# EasyEDA Pro project ProPrj_2 模块_2024-10-26.epro

# Schematic Schematic1
Board Name: Board1; Create Date: 2024-10-13; Page Name: P1; Project Name: 2 模块; Schematic Name: Schematic1; Update Date: 2024-10-16; Company: 嘉立创EDA; Page Size: A4; Version: V1.0
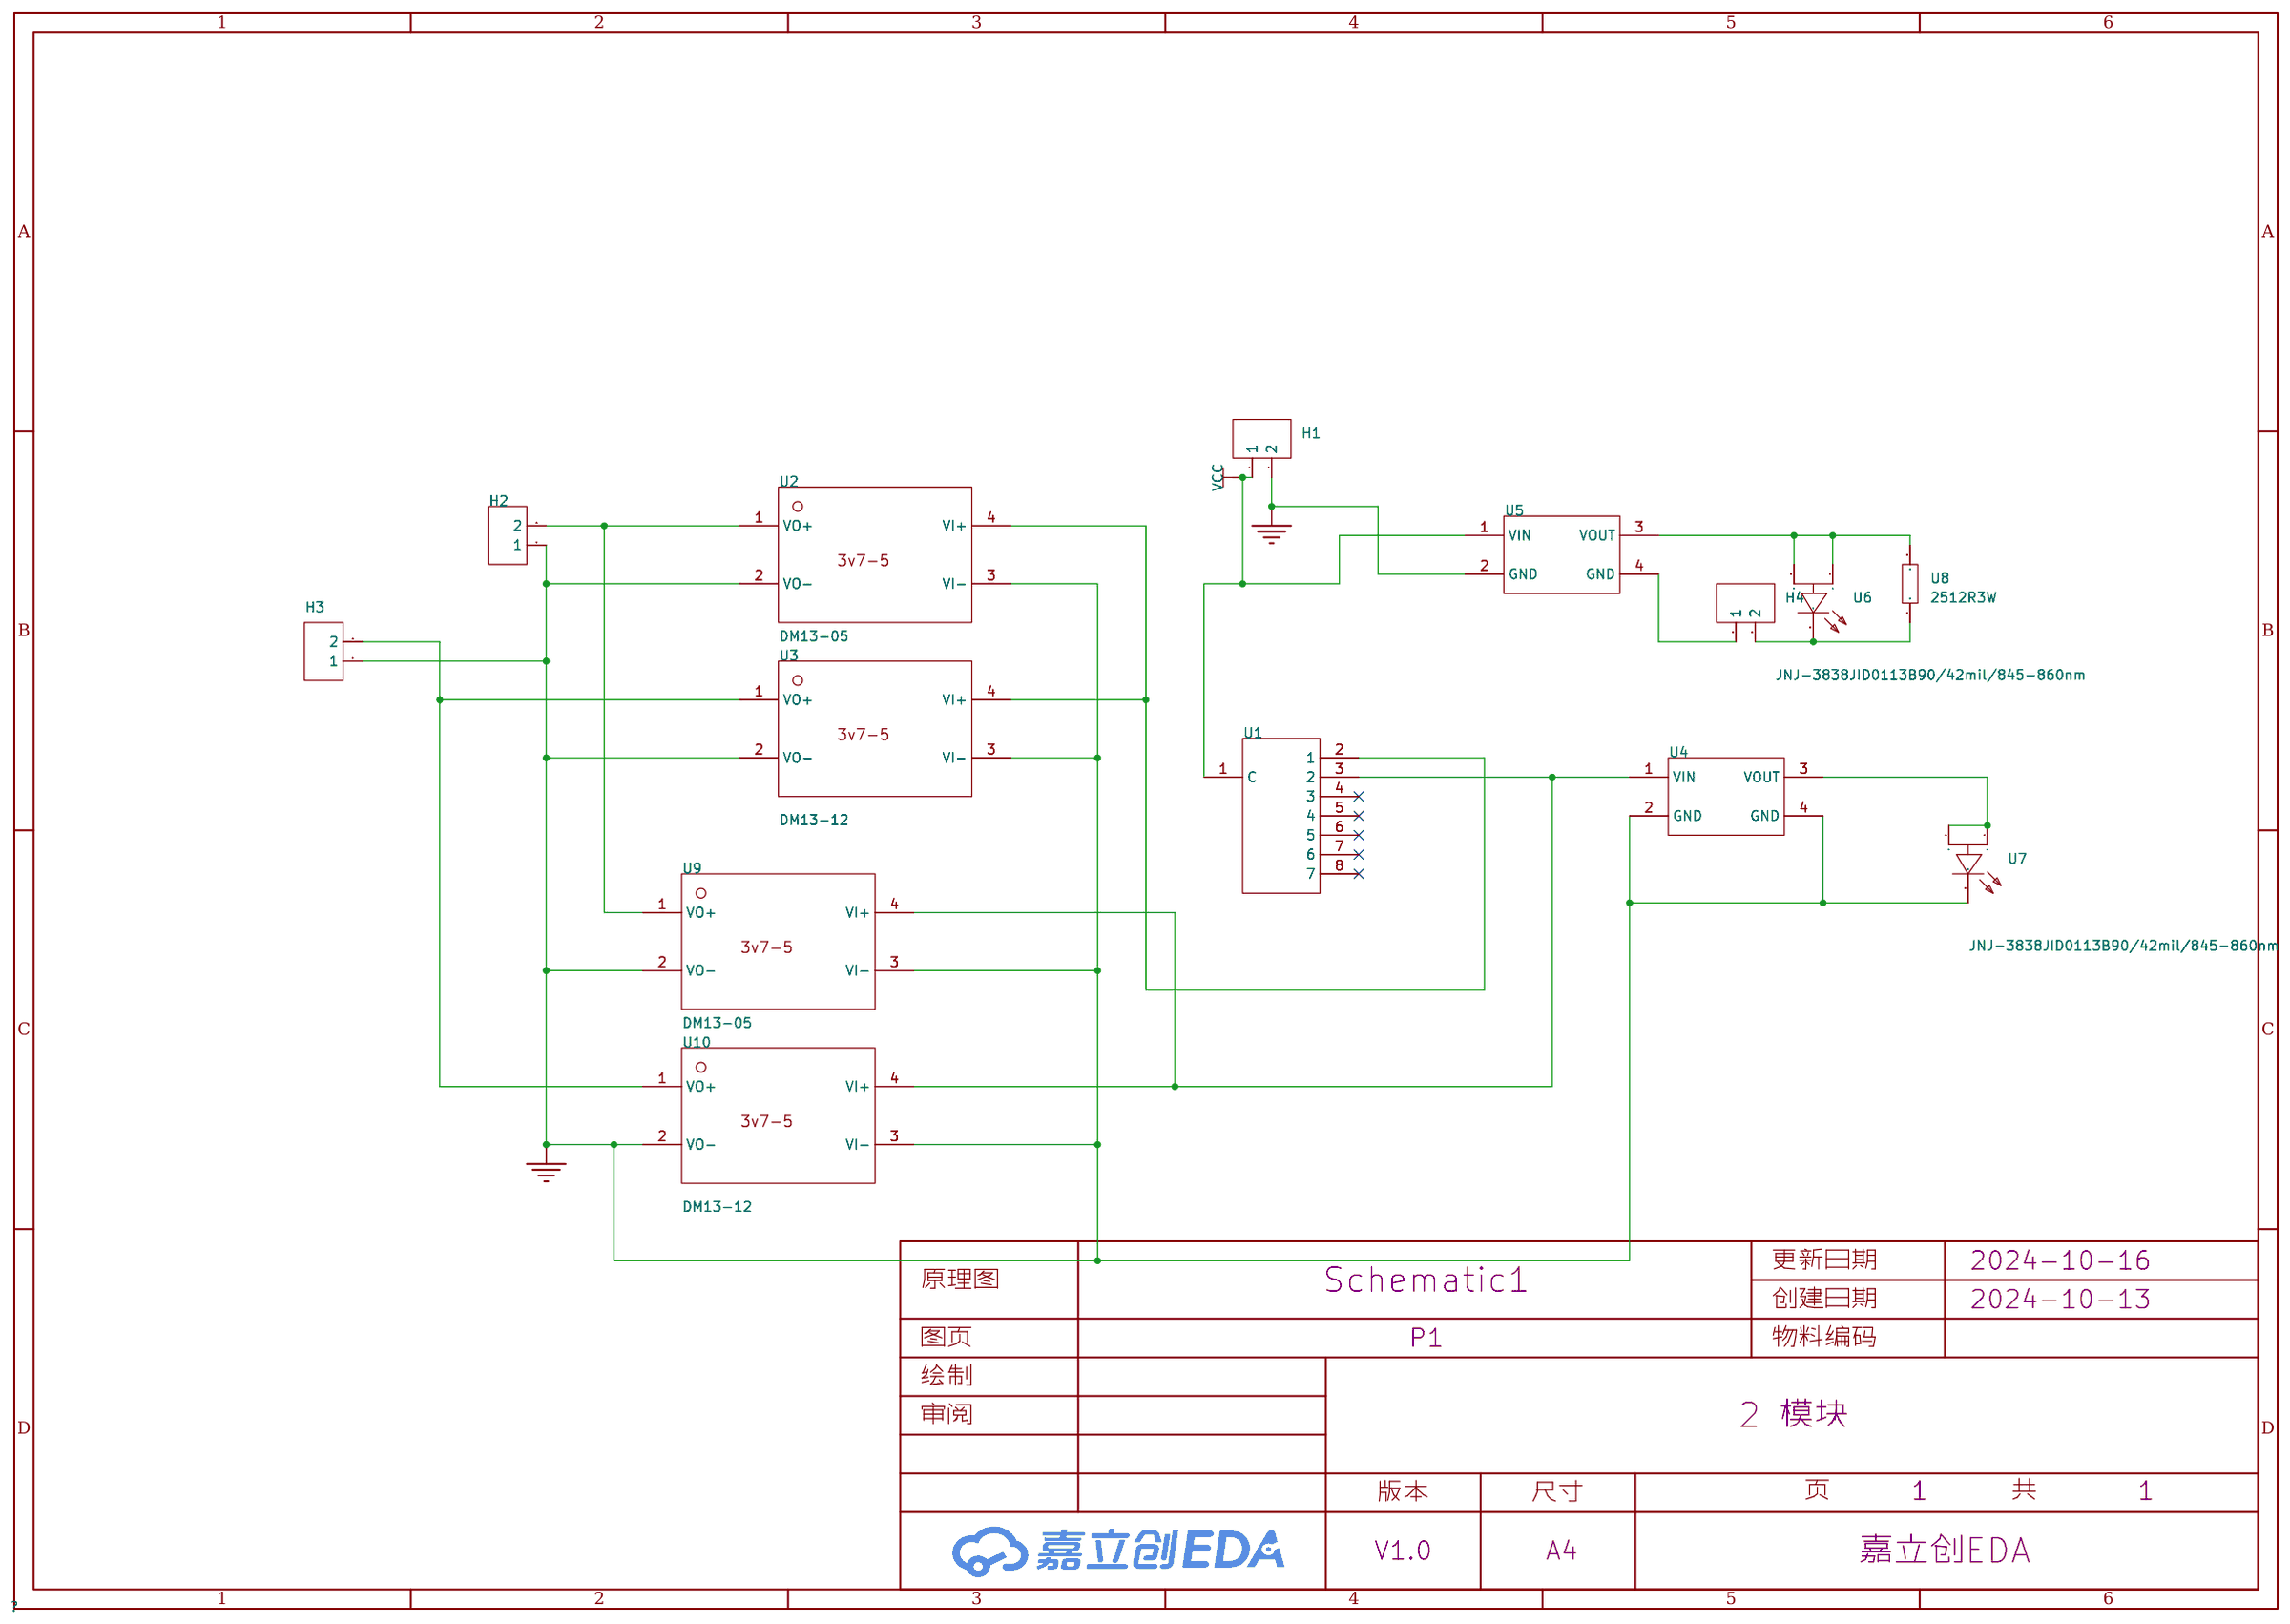
[diagram p0: schematic sheet]

## Parts
H1  -  [HDR-TH_2P-P2.54-V-F]
H2  -  [HDR-TH_2P-P2.54-V-F]
H3  -  [HDR-TH_2P-P2.54-V-F]
H4  -  [HDR-TH_2P-P2.54-V-F]
U1  -  [HDR-TH_3P-P2.54-V-F]
U2  DM13-05  [DM13-05]
U3  DM13-12  [DM13-05]
U4  AMS1117模块 COPY  [D01]
U5  AMS1117模块 COPY  [D01]
U6  JNJ-3838JID0113B90/42mil/845-860nm  [LED-SMD_3P-L3.8-W3.8_JNJ-3838JI0113B90]
U7  JNJ-3838JID0113B90/42mil/845-860nm  [LED-SMD_3P-L3.8-W3.8_JNJ-3838JI0113B90]
U8  2512R3W  [R2512]
U9  DM13-05  [DM13-05]
U10  DM13-12  [DM13-05]

## Library data of the parts
H1-H4 = HDR-F_2.54_1x2P: Supplier Part: C49661; Supplier Footprint: 插件
U1 = mini小型旋转波段开关: https://detail.tmall.com/item.htm?abbucket=20&id=710720328864&ns=1&skuId=4986250817052&spm=a21n57.1.0.0.6947523cw75yEM
U2 U3 U9 U10 = DM13-05: 3.7-5; _: 3
U4 U5 = AMS1117模块 COPY: Supplier: risym; link: https://m.tb.cn/h.VOj4bnW?sm=f9af33
U6 U7 = JNJ-3838JID0113B90/42mil/845-860nm: 正向电压:2.8V~3.6V;波长:840nm~870nm;辐射强度:900mW/Sr;正向电流-DC (If):1A;视角:90°;; LCSC Part Name: 3838晶元堆叠42mil球头90度灯源845-860nm; Supplier Part: C19185848; Manufacturer: JNJ OPTOELECTRONICS(强生光电); Supplier Footprint: 3838; JLCPCB Part Class: 扩展库; Datasheet: https://atta.szlcsc.com/upload/public/pdf/source/20231103/777D8A6519DA7058B88AF7E8216F8756.pdf; Supplier: LCSC; Vf - Forward Voltage: 2.8V~3.6V; Wavelength: 840nm~870nm; Radiant Intensity: 900mW/Sr; Current - DC Forward (If): 1A; View Angle: 90°; Operating Temperature: -40℃~+100℃
U8 = 2512R3W: Supplier Part: C9900003295; JLCPCB Part Class: 扩展库; Supplier: LCSC

## Nets
GND: H1.2 H2.1 H3.1 U2.2(VO-) U2.3(VI-) U3.2(VO-) U3.3(VI-) U4.2(GND) U4.4(GND) U5.2(GND) U7.3(K) U9.2(VO-) U9.3(VI-) U10.2(VO-) U10.3(VI-)
VCC: H1.1 U1.1(C) U5.1(VIN)
$1N3243: U5.3(VOUT) U6.1(A) U6.2(A) U8.2
$1N3257: H4.1 U5.4(GND)
$1N3292: H4.2 U6.3(K) U8.1
$1N3305: U4.3(VOUT) U7.1(A) U7.2(A)
Net-(H2-2): H2.2 U2.1(VO+) U9.1(VO+)
Net-(H3-2): H3.2 U3.1(VO+) U10.1(VO+)
Net-(U1-2): U1.2(1) U2.4(VI+) U3.4(VI+)
Net-(U1-3): U1.3(2) U4.1(VIN) U9.4(VI+) U10.4(VI+)

Not connected (* = marked no-connect by the designer): U1 4(3)* 5(4)* 6(5)* 7(6)* 8(7)*

# Board PCB1
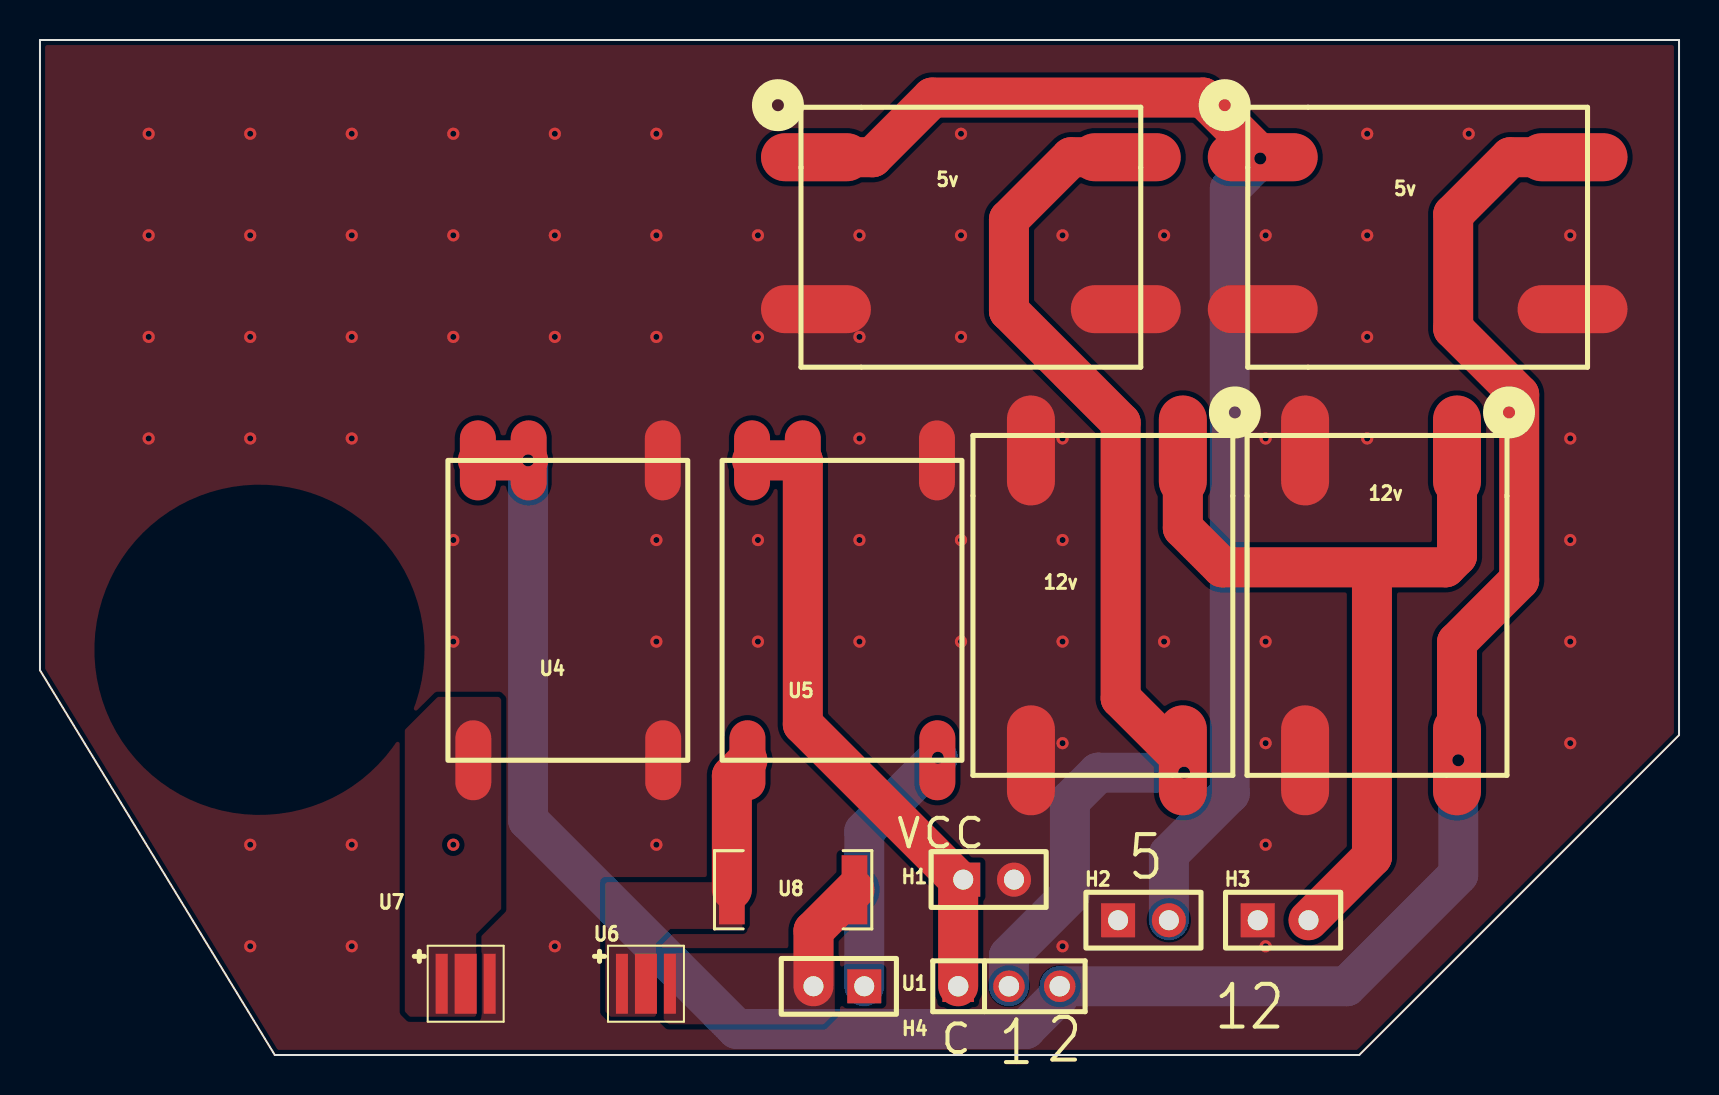
[diagram p1: board, top side]
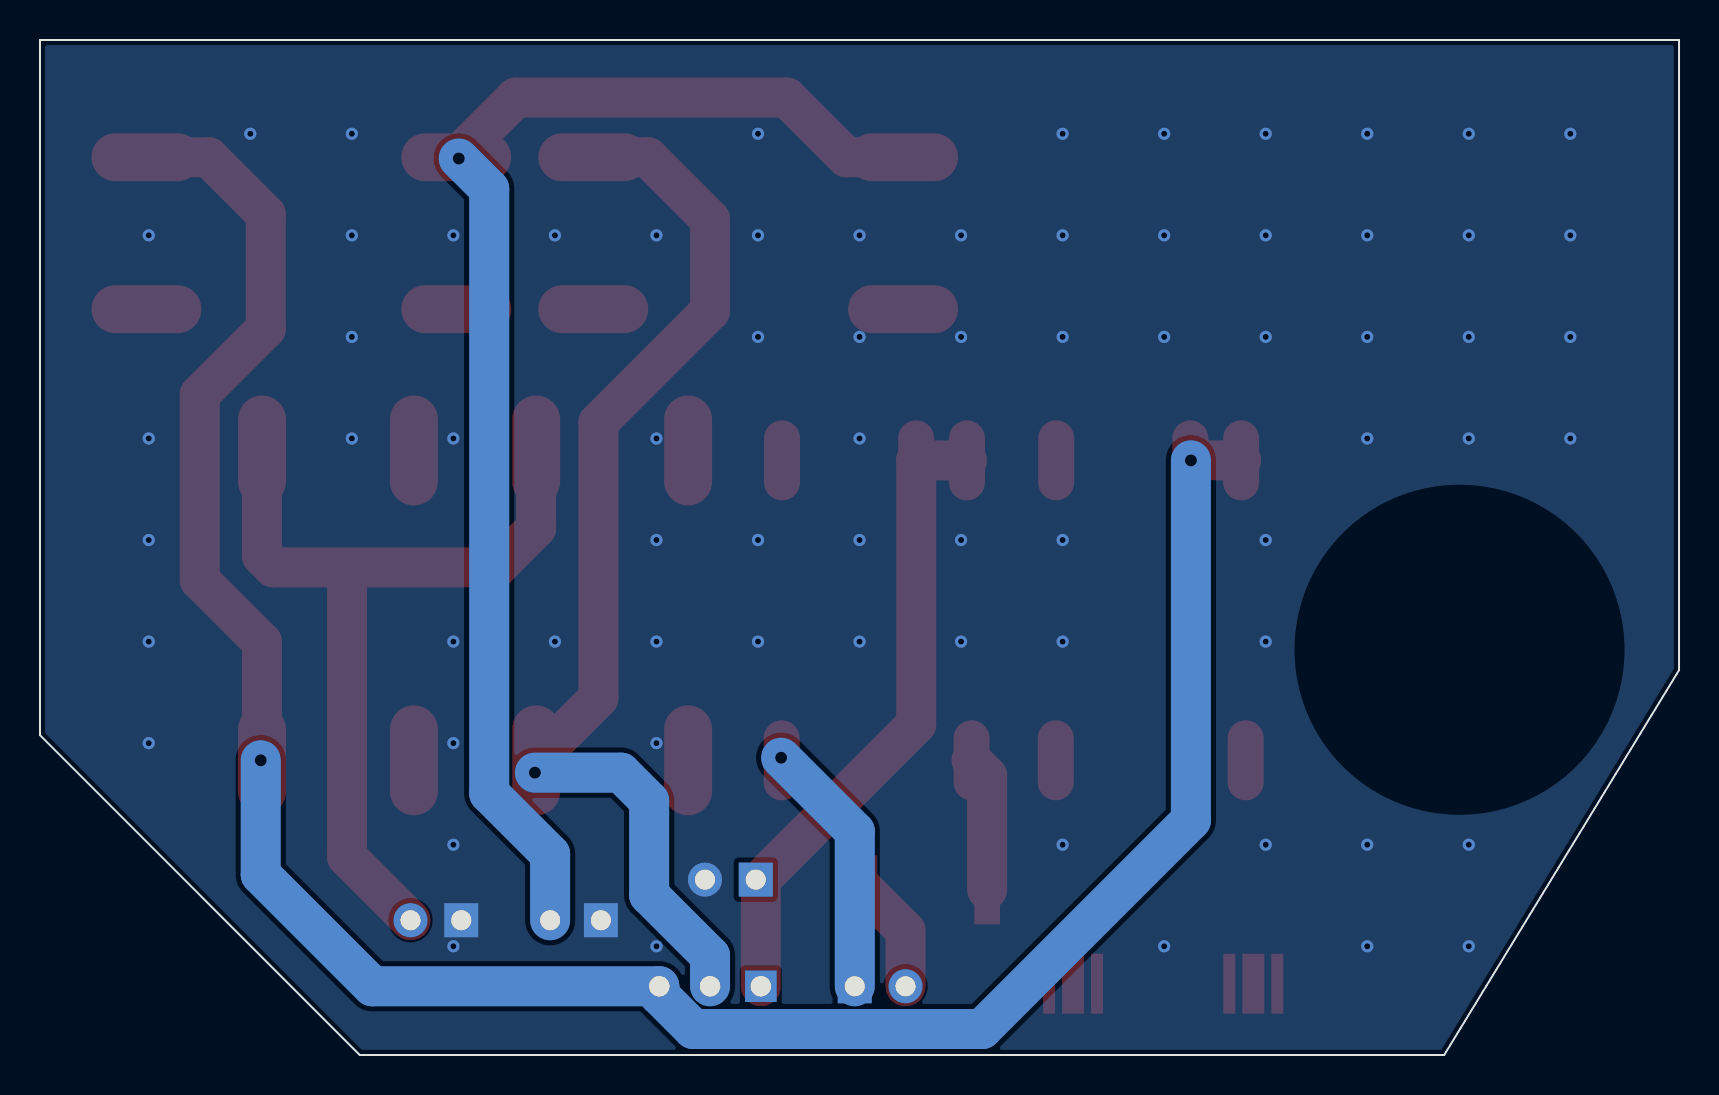
[diagram p2: board, bottom side, seen from below]

Outline 82 x 50.77 mm; copper layers: Top Layer, Bottom Layer. Coordinates in mm from the lower left corner of the outline.
Outline path: 0,50.77 0,19.25 11.75,0 66,0 82,16 82,50.77 0,50.77
Stack: Top Layer 0.035mm / Dielectric1 1.51mm FR4 er 4.5 / Bottom Layer 0.035mm

## Design rules (mm)
template: 自定义配置
spacing copperThickness1oz (default): track to track 0.102, other pairs 0.152 to 0.3
spacing copperThickness2oz: track to track 0.203, other pairs 0.152 to 0.3
track width copperThickness1oz (default): min 0.127, default 0.254, max 2.54
track width copperThickness2oz: min 0.203, default 0.254, max 2.54
differential pair differentialPair (default): width min 0.127, default 0.254, max 2.54; gap min 0.152, default 0.152
via viaSize (default): diameter min 0.5, default 0.61, max 10; hole min 0.3, default 0.305, max 6.3

## Placement (name value [footprint] x y rotation side)
5v  -  [DM13-05]  46.57 40.9 0 top
5v#2  -  [DM13-05]  68.92 40.9 0 top
12v  -  [DM13-05]  53.17 22.49 270 top
12v#2  -  [DM13-05]  66.89 22.49 270 top
H1  -  [HDR-TH_2P-P2.54-V-F]  47.46 8.77 0 top
H2  -  [HDR-TH_2P-P2.54-V-F]  55.21 6.74 0 top
H3  -  [HDR-TH_2P-P2.54-V-F]  62.19 6.74 0 top
H4  -  [HDR-TH_2P-P2.54-V-F]  39.97 3.44 180 top
U1  -  [HDR-TH_3P-P2.54-V-F]  48.48 3.44 0 top
U4  AMS1117模块 COPY  [D01]  27.39 22.62 90 top
U5  AMS1117模块 COPY  [D01]  41.11 22.62 90 top
U6  JNJ-3838JID0113B90/42mil/845-860nm  [LED-SMD_3P-L3.8-W3.8_JNJ-3838JI0113B90]  30.32 3.57 0 top
U7  JNJ-3838JID0113B90/42mil/845-860nm  [LED-SMD_3P-L3.8-W3.8_JNJ-3838JI0113B90]  21.3 3.57 0 top
U8  2512R3W  [R2512]  37.68 8.26 180 top

## Footprints (pads in the part's own frame, mm; a bottom-side part is the same pattern mirrored in y, then rotated)
D01
  oval 4x1.8 smd: 1(7.126,5.486) 1(7.126,2.946) 2(7.126,-3.765) 3(-7.874,5.715) 4(-7.874,-3.785)
DM13-05
  oval 5.499x2.401 smd: 1(-7.75,4) 2(-7.75,-3.599) 3(7.75,-3.599) 4(7.75,4)
HDR-TH_2P-P2.54-V-F
  rect 1.7x1.7 hole 1: 1(-1.27,0)
  round 1.7 hole 1: 2(1.27,0)
HDR-TH_3P-P2.54-V-F
  rect 1.575x1.575 hole 1.02: 1(-2.54,0)
  round 1.575 hole 1.02: 2(0,0) 3(2.54,0)
LED-SMD_3P-L3.8-W3.8_JNJ-3838JI0113B90
  rect 0.6x3 smd: 1(-1.2,0) 3(1.2,0)
  rect 1.1x3 smd: 2(0,0)
R2512
  rect 1.282x3.456 smd: 1(-3.067,0) 2(3.067,0)

## Nets
GND: 5v.2 5v.3 5v#2.2 5v#2.3 12v.2 12v.3 12v#2.2 12v#2.3 H1.2 H2.1 H3.1 U4.2 U4.4 U5.2 U7.3
VCC: H1.1 U1.1 U5.1
$1N2924: 5v.1 5v#2.1 H2.2
$1N2940: 12v.1 12v#2.1 H3.2
$1N3069: 5v#2.4 12v#2.4 U1.3 U4.1
$1N3141: 5v.4 12v.4 U1.2
$1N3243: U5.3 U6.1 U6.2 U8.2
$1N3257: H4.1 U5.4
$1N3292: H4.2 U6.3 U8.1
$1N3305: U4.3 U7.1 U7.2

## Via types
v1: diameter 0.61, hole 0.305, Top Layer to Bottom Layer, 70 vias
v2: diameter 1, hole 0.6, Top Layer to Bottom Layer, 5 vias

## Routing (per net, layer and track width the routed paths; a pad name or vN(x,y) marks a point on that pad's centre or on a via; arc(x,y) is an arc through that point)
GND:
  vias: v1(5.44,46.08) v1(5.44,41) v1(5.44,35.92) v1(5.44,30.84) v1(10.52,46.08) v1(10.52,41) v1(10.52,35.92) v1(10.52,30.84) v1(10.52,10.52) v1(10.52,5.44) v1(15.6,46.08) v1(15.6,41) v1(15.6,35.92) v1(15.6,30.84) v1(15.6,10.52) v1(15.6,5.44) v1(20.68,46.08) v1(20.68,41) v1(20.68,35.92) v1(20.68,25.76) v1(20.68,20.68) v1(20.68,10.52) v1(25.76,46.08) v1(25.76,41) v1(25.76,35.92) v1(25.76,5.44) v1(30.84,46.08) v1(30.84,41) v1(30.84,35.92) v1(30.84,25.76) v1(30.84,20.68) v1(30.84,10.52) v1(35.92,41) v1(35.92,35.92) v1(35.92,25.76) v1(35.92,20.68) v1(41,41) v1(41,35.92) v1(41,30.84) v1(41,25.76) v1(41,20.68) v1(46.08,46.08) v1(46.08,41) v1(46.08,35.92) v1(46.08,25.76) v1(46.08,20.68) v1(51.16,41) v1(51.16,30.84) v1(51.16,25.76) v1(51.16,20.68) v1(51.16,15.6) v1(51.16,5.44) v1(56.24,41) v1(56.24,20.68) v1(61.32,41) v1(61.32,30.84) v1(61.32,20.68) v1(61.32,15.6) v1(61.32,10.52) v1(61.32,5.44) v1(66.4,46.08) v1(66.4,41) v1(66.4,35.92) v1(66.4,30.84) v1(71.48,46.08) v1(76.56,41) v1(76.56,30.84) v1(76.56,25.76) v1(76.56,20.68) v1(76.56,15.6)
VCC: length 32.1
  Top Layer w2: U1.1 45.94,8.77 38.16,16.54 U5.1 U5.1
$1N2924: length 64.8
  Top Layer w2: 5v#2.1 58.19,47.89 44.63,47.89 41.65,44.9 5v.1
  Bottom Layer w2: v2(61.05,44.84) 59.53,43.32 59.53,13.09 56.48,10.04 H2.2
$1N2940: length 42.6
  Top Layer w2: 12v.1 57.18,26.36 59.14,24.39 70.32,24.39 70.89,24.97 12v#2.1 ; H3.2 66.64,9.92 66.64,24.14
$1N3069: length 117.7
  Top Layer w2: 12v#2.4 70.89,20.65 74,23.76 74,33.03 70.7,36.33 70.7,42.05 73.56,44.9 5v#2.4 ; v2(24.42,29.74) U4.1
  Bottom Layer w2: v2(24.42,29.74) 24.42,11.75 34.87,1.3 49.31,1.3 51.02,3.01 U1.3 65.37,3.44 70.95,9.03 v2(70.95,14.74)
$1N3141: length 54.6
  Top Layer w2: 5v.4 51.59,44.9 48.48,41.79 48.48,37.22 54.06,31.63 54.06,17.85 12v.4
  Bottom Layer w2: U1.2 48.48,4.96 51.52,8.01 51.52,12.71 52.94,14.12 v2(57.24,14.12)
$1N3243: length 6.8
  Top Layer w2: U8.2 34.61,13.96 U5.3
$1N3257: length 13
  Bottom Layer w2: v2(44.92,14.87) 41.24,11.19 H4.1
$1N3292: length 5.7
  Top Layer w2: H4.2 38.7,6.21 U8.1

## Copper pours and planes (outline as drawn; the poured copper is in the pictures)
GND on Top Layer: -14.64,68.84 102.83,68.84 102.83,-19.8 -14.64,-19.8
GND on Bottom Layer: -25.18,65.67 97.5,65.67 97.5,-13.45 -25.18,-13.45
$1N3243 on Top Layer: 30.82,1.91 28.54,1.91 28.28,2.17 28.28,8.65 35.14,8.65 35.14,6.31 31.53,6.31 30.82,5.6
$1N3292 on Top Layer: 31.2,5.09 39.5,5.09 39.76,4.83 39.76,2.09 39.2,1.53 31.46,1.53 31.2,1.79
$1N3305 on Top Layer: 18.5,1.91 18.25,2.17 18.25,16.27 19.9,17.92 22.95,17.92 23.08,17.79 23.08,7.31 21.83,6.06 21.83,1.91

## Text on the board
Top Silkscreen Layer: vcc | c | 1 | 2 | 5 | 12
